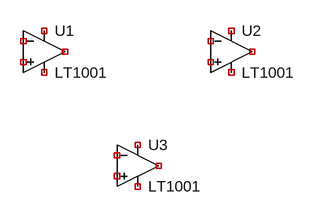
[diagram p0: schematic Draft2.asc]
Draft2.asc, the LTspice schematic file:
Version 4
SHEET 1 880 680
SYMBOL OpAmps\\LT1001 144 96 R0
SYMATTR InstName U1
SYMBOL OpAmps\\LT1001 432 96 R0
SYMATTR InstName U2
SYMBOL OpAmps\\LT1001 288 272 R0
SYMATTR InstName U3

The netlist it stands for:
* Draft2.asc
XU1 NC_01 NC_02 NC_03 NC_04 NC_05 LT1001  ; pins In+ In- V+ V- OUT
XU2 NC_06 NC_07 NC_08 NC_09 NC_10 LT1001  ; pins In+ In- V+ V- OUT
XU3 NC_11 NC_12 NC_13 NC_14 NC_15 LT1001  ; pins In+ In- V+ V- OUT
.lib LTC.lib
.backanno
.end